# Altium schematic sheet Power_Supply.SchDoc: Dahlia Carrier Board
size A3; Organization: Toradex AG; Address1: Ebenaustrasse 10; Address2: Horw; Address3: 6048; Address4: Switzerland; DocumentNumber: 3; Revision: V1.1; SheetNumber: 3; SheetTotal: 21; PageSetup: Record=PageOptions|CenterHorizontal=True|CenterVertical=True|PrintScale=0.71|XCorrection=1.00|YCorrection=1.00|PrintKind=1|BorderSize=5000000|LeftOffset=0|BottomOffset=0|Orientation=2|PaperLength=1000|PaperWidth=1000|Scale=100|PaperSource=15|PrintQuality=600|MediaType=1|DitherType=10|PaperKind=A4|PrintScaleMode=1
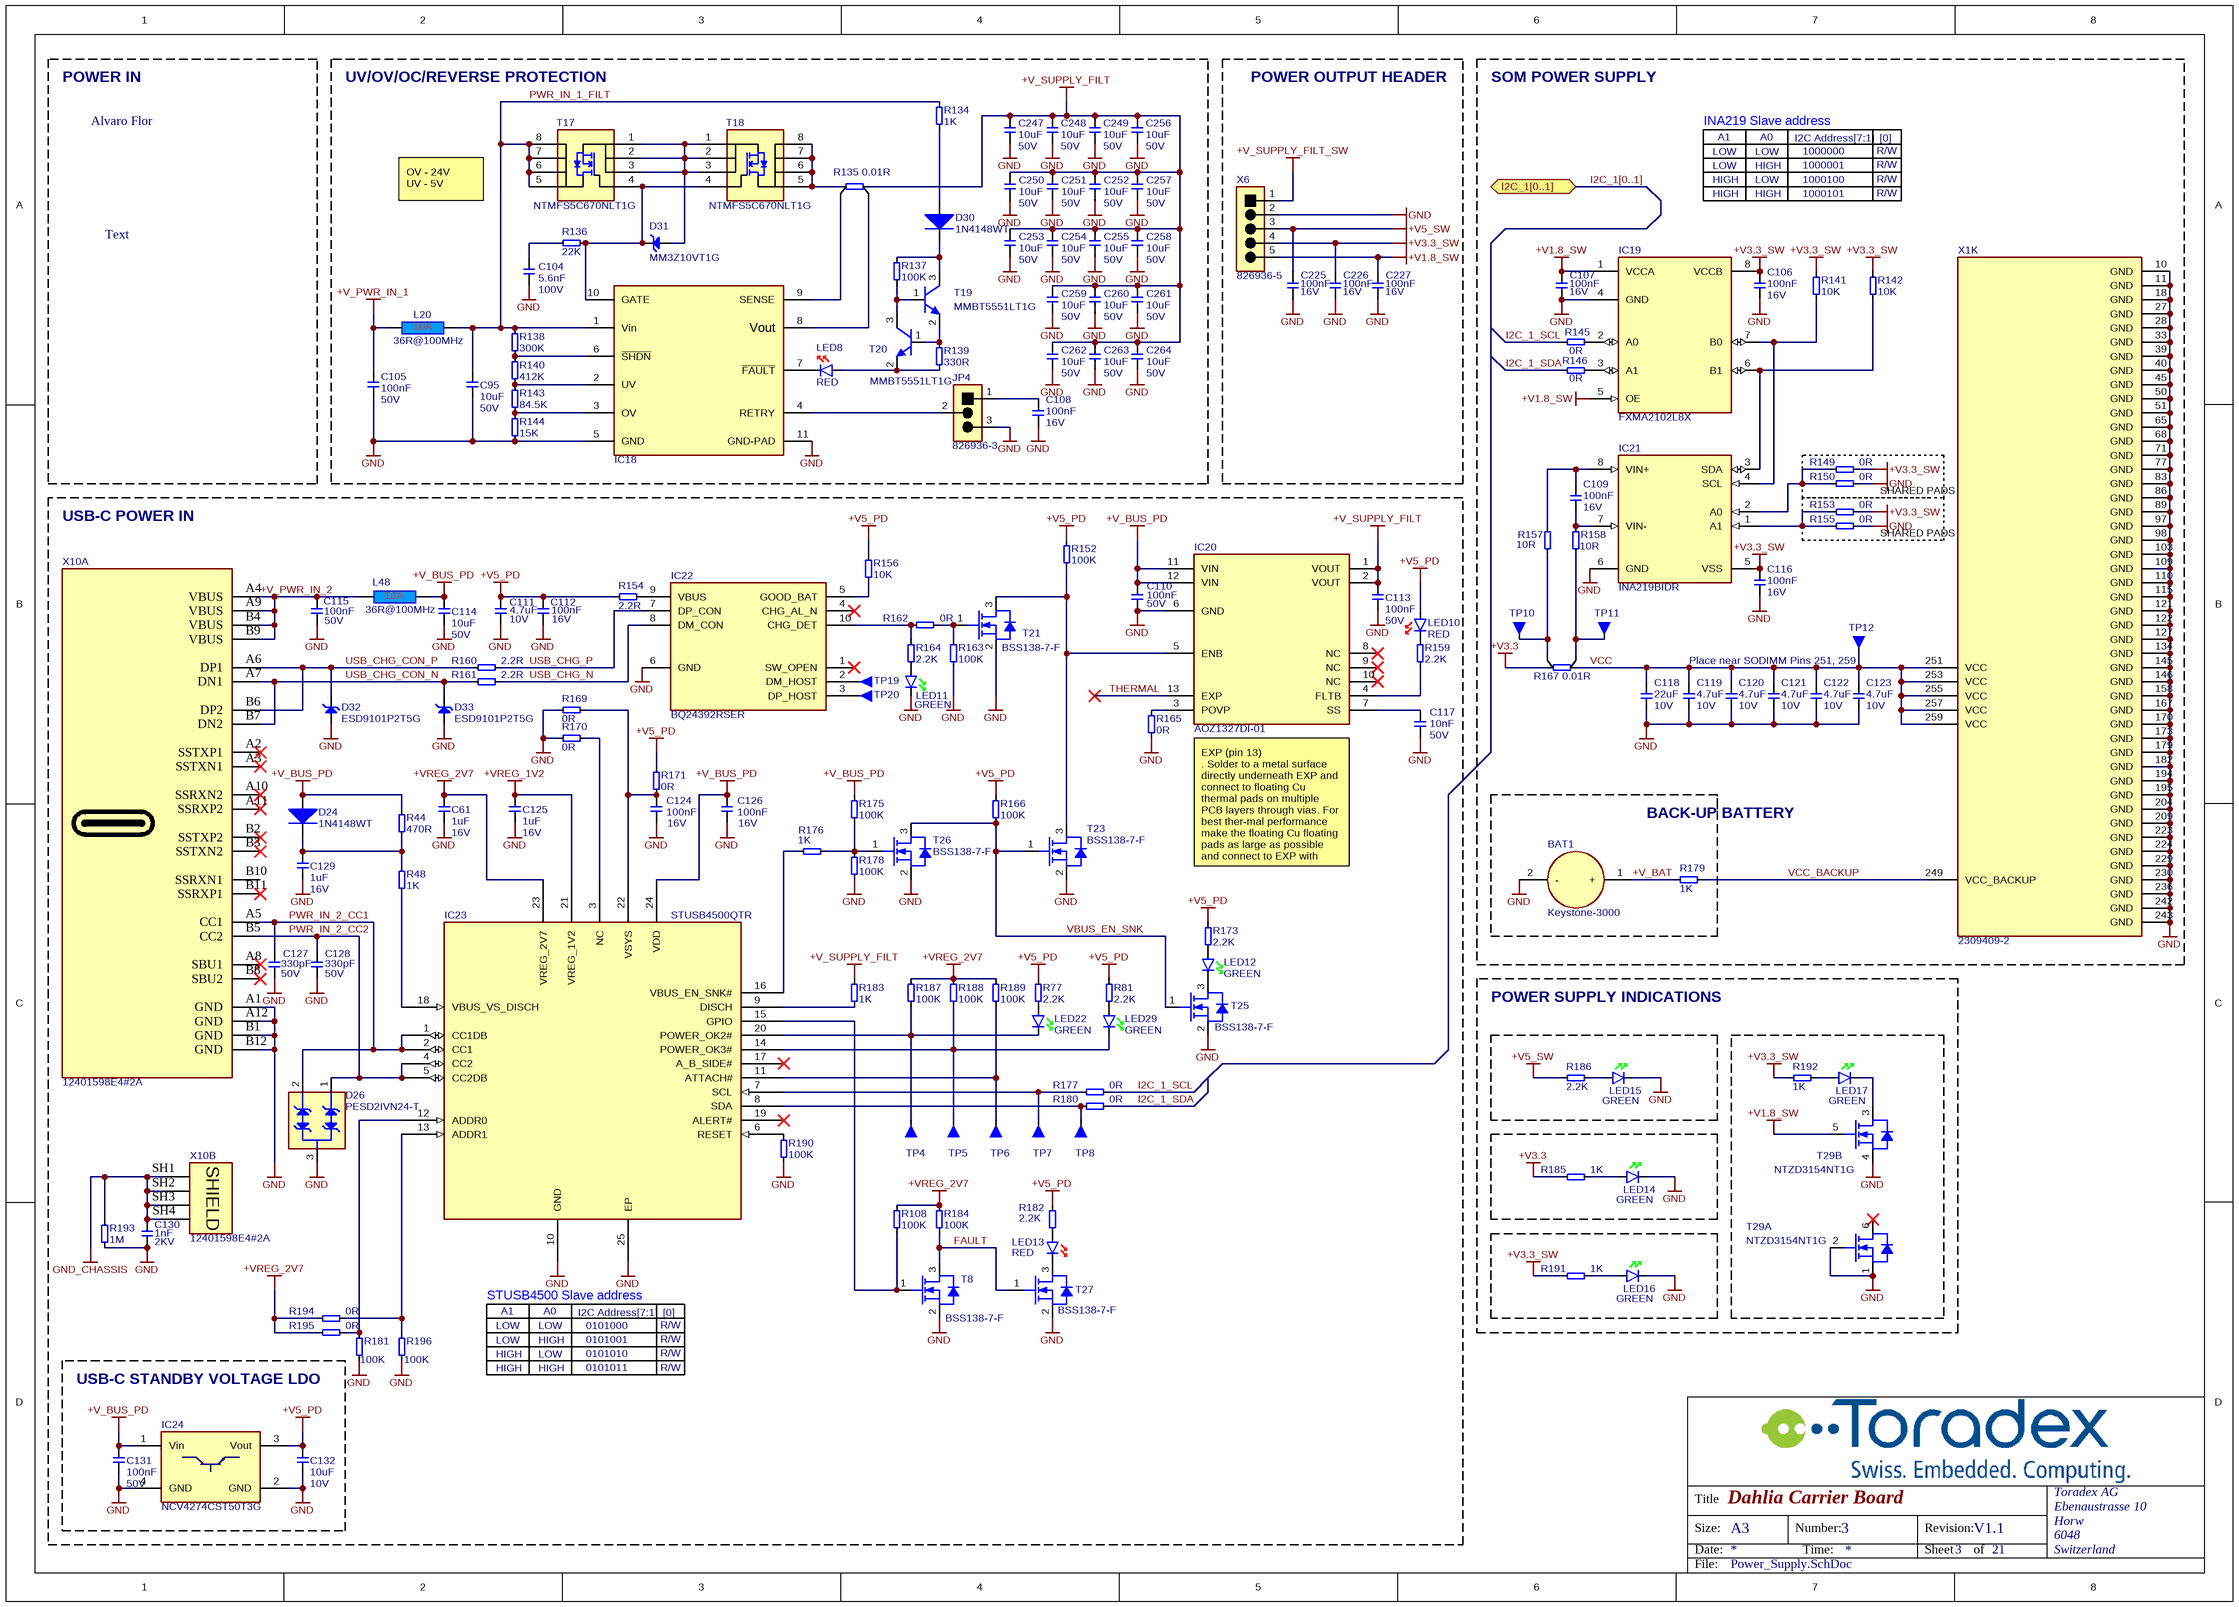
[diagram p0: Power_Supply.SchDoc]

## Parts
BAT1  Keystone-3000  [T_Keystone_3000]
C61  Rating: 16V  [CAPC1005X60N]  (hidden comment: 1uF)
C95  Rating: 50V  [T_CAPC1206X60N]  (hidden comment: 10uF)
C104  Rating: 100V  [T_CAPC1206X180N]  (hidden comment: 5.6nF)
C105  Rating: 50V  [CAPC1005X60N]  (hidden comment: 100nF)
C106  Rating: 16V  [CAPC1005X60N]  (hidden comment: 100nF)
C107  Rating: 16V  [CAPC1005X60N]  (hidden comment: 100nF)
C108  Rating: 16V  [CAPC1005X60N]  (hidden comment: 100nF)
C109  Rating: 16V  [CAPC1005X60N]  (hidden comment: 100nF)
C110  Rating: 50V  [CAPC1005X60N]  (hidden comment: 100nF)
C111  Rating: 10V  [T_CAPC0603X33N]  (hidden comment: 4.7uF)
C112  Rating: 16V  [CAPC1005X60N]  (hidden comment: 100nF)
C113  Rating: 50V  [CAPC1005X60N]  (hidden comment: 100nF)
C114  Rating: 50V  [T_CAPC1206X60N]  (hidden comment: 10uF)
C115  Rating: 50V  [CAPC1005X60N]  (hidden comment: 100nF)
C116  Rating: 16V  [CAPC1005X60N]  (hidden comment: 100nF)
C117  Rating: 50V  [CAPC1005X60N]  (hidden comment: 10nF)
C118  Rating: 10V  [T_CAPC0805X125N]  (hidden comment: 22uF)
C119  Rating: 10V  [T_CAPC0603X33N]  (hidden comment: 4.7uF)
C120  Rating: 10V  [T_CAPC0603X33N]  (hidden comment: 4.7uF)
C121  Rating: 10V  [T_CAPC0603X33N]  (hidden comment: 4.7uF)
C122  Rating: 10V  [T_CAPC0603X33N]  (hidden comment: 4.7uF)
C123  Rating: 10V  [T_CAPC0603X33N]  (hidden comment: 4.7uF)
C124  Rating: 16V  [CAPC1005X60N]  (hidden comment: 100nF)
C125  Rating: 16V  [CAPC1005X60N]  (hidden comment: 1uF)
C126  Rating: 16V  [CAPC1005X60N]  (hidden comment: 100nF)
C127  Rating: 50V  [CAPC1005X60N]  (hidden comment: 330pF)
C128  Rating: 50V  [CAPC1005X60N]  (hidden comment: 330pF)
C129  Rating: 16V  [CAPC1005X60N]  (hidden comment: 1uF)
C130  Rating: 2KV  [T_CAPC1206X180N]  (hidden comment: 1nF)
C131  Rating: 50V  [CAPC1005X60N]  (hidden comment: 100nF)
C132  Rating: 10V  [T_CAPC0603X33N]  (hidden comment: 10uF)
C225  Rating: 16V  [CAPC1005X60N]  (hidden comment: 100nF)
C226  Rating: 16V  [CAPC1005X60N]  (hidden comment: 100nF)
C227  Rating: 16V  [CAPC1005X60N]  (hidden comment: 100nF)
C247  Rating: 50V  [T_CAPC1206X60N]  (hidden comment: 10uF)
C248  Rating: 50V  [T_CAPC1206X60N]  (hidden comment: 10uF)
C249  Rating: 50V  [T_CAPC1206X60N]  (hidden comment: 10uF)
C250  Rating: 50V  [T_CAPC1206X60N]  (hidden comment: 10uF)
C251  Rating: 50V  [T_CAPC1206X60N]  (hidden comment: 10uF)
C252  Rating: 50V  [T_CAPC1206X60N]  (hidden comment: 10uF)
C253  Rating: 50V  [T_CAPC1206X60N]  (hidden comment: 10uF)
C254  Rating: 50V  [T_CAPC1206X60N]  (hidden comment: 10uF)
C255  Rating: 50V  [T_CAPC1206X60N]  (hidden comment: 10uF)
C256  Rating: 50V  [T_CAPC1206X60N]  (hidden comment: 10uF)
C257  Rating: 50V  [T_CAPC1206X60N]  (hidden comment: 10uF)
C258  Rating: 50V  [T_CAPC1206X60N]  (hidden comment: 10uF)
C259  Rating: 50V  [T_CAPC1206X60N]  (hidden comment: 10uF)
C260  Rating: 50V  [T_CAPC1206X60N]  (hidden comment: 10uF)
C261  Rating: 50V  [T_CAPC1206X60N]  (hidden comment: 10uF)
C262  Rating: 50V  [T_CAPC1206X60N]  (hidden comment: 10uF)
C263  Rating: 50V  [T_CAPC1206X60N]  (hidden comment: 10uF)
C264  Rating: 50V  [T_CAPC1206X60N]  (hidden comment: 10uF)
D24  1N4148WT  [SOD-523F]
D26  PESD2IVN24-T  [SOT95P230X110-3N]
D30  1N4148WT  [SOD-523F]
D31  MM3Z10VT1G  [T_SOD-323]
D32  ESD9101P2T5G  [SOD-923]
D33  ESD9101P2T5G  [SOD-923]
IC18  LTC4368IDD-2#PBF  [IC-DFN50P300X300X75-10N]  (value not drawn)
IC19  FXMA2102L8X  [IC-MicroPak50P160X2160X55-8N]
IC20  AOZ1327DI-01  [IC-A&O-AOZ1327DI-01]
IC21  Manufacturer Part No.: INA219BIDR  [SOIC127P600X173-8N]  (hidden comment: INA219)
IC22  BQ24392RSER  [IC-TI-BQ24392RSER]
IC23  STUSB4500QTR  [T_STUSB4500QTR]
IC24  NCV4274CST50T3G  [T_ON_NCV4264-2ST50T3G]
JP4  826936-3  [T_TYCO_826936-3]
L20  36R@100MHz  [T_Laird_35F0121-0SR-10]
L48  36R@100MHz  [T_Laird_35F0121-0SR-10]
LED8  Color: RED  [T_Liteon_LTST-C190KRKT]  (hidden comment: LTST-C190KRKT)
LED10  Color: RED  [T_Liteon_LTST-C190KRKT]  (hidden comment: LTST-C190KRKT)
LED11  Color: GREEN  [T_Liteon_LTST-C190GKT]  (hidden comment: LTST-C190GKT)
LED12  Color: GREEN  [T_Liteon_LTST-C190GKT]  (hidden comment: LTST-C190GKT)
LED13  Color: RED  [T_Liteon_LTST-C190KRKT]  (hidden comment: LTST-C190KRKT)
LED14  Color: GREEN  [T_Liteon_LTST-C190GKT]  (hidden comment: LTST-C190GKT)
LED15  Color: GREEN  [T_Liteon_LTST-C190GKT]  (hidden comment: LTST-C190GKT)
LED16  Color: GREEN  [T_Liteon_LTST-C190GKT]  (hidden comment: LTST-C190GKT)
LED17  Color: GREEN  [T_Liteon_LTST-C190GKT]  (hidden comment: LTST-C190GKT)
LED22  Color: GREEN  [T_Liteon_LTST-C190GKT]  (hidden comment: LTST-C190GKT)
LED29  Color: GREEN  [T_Liteon_LTST-C190GKT]  (hidden comment: LTST-C190GKT)
R44  470R  [T_RESC0603X30N]
R48  1K  [T_RESC0603X30N]
R77  2.2K  [RESC1005X40N]
R81  2.2K  [RESC1005X40N]
R108  100K  [RESC1005X40N]
R134  1K  [RESC1005X40N]
R135  0.01R  [RESWSK1206]
R136  22K  [RESC3216X75N]
R137  100K  [RESC1005X40N]
R138  300K  [RESC3216X75N]
R139  330R  [RESC1005X40N]
R140  412K  [RESC3216X75N]
R141  10K  [RESC1005X40N]
R142  10K  [RESC1005X40N]
R143  84.5K  [RESC3216X75N]
R144  15K  [RESC3216X75N]
R145  0R  [T_RESC0603X30N]
R146  0R  [T_RESC0603X30N]
R149  0R  [T_RESC0603X30N]
R150  0R  [T_RESC0603X30N]
R152  100K  [RESC1005X40N]
R153  0R  [T_RESC0603X30N]
R154  2.2R  [T_RESC0603X30N]
R155  0R  [T_RESC0603X30N]
R156  10K  [RESC1005X40N]
R157  10R  [RESC1005X40N]
R158  10R  [RESC1005X40N]
R159  2.2K  [RESC1005X40N]
R160  2.2R  [T_RESC0603X30N]
R161  2.2R  [T_RESC0603X30N]
R162  0R  [T_RESC0603X30N]
R163  100K  [RESC1005X40N]
R164  2.2K  [RESC1005X40N]
R165  0R  [T_RESC0603X30N]
R166  100K  [RESC1005X40N]
R167  0.01R  [RESWSK1206]
R169  0R  [T_RESC0603X30N]
R170  0R  [T_RESC0603X30N]
R171  0R  [T_RESC0603X30N]
R173  2.2K  [RESC1005X40N]
R175  100K  [RESC1005X40N]
R176  1K  [T_RESC0603X30N]
R177  0R  [T_RESC0603X30N]
R178  100K  [RESC1005X40N]
R179  1K  [RESC1005X40N]
R180  0R  [T_RESC0603X30N]
R181  100K  [RESC1005X40N]
R182  2.2K  [RESC1005X40N]
R183  1K  [T_RESC0603X30N]
R184  100K  [RESC1005X40N]
R185  1K  [RESC1005X40N]
R186  2.2K  [RESC1005X40N]
R187  100K  [RESC1005X40N]
R188  100K  [RESC1005X40N]
R189  100K  [RESC1005X40N]
R190  100K  [RESC1005X40N]
R191  1K  [RESC1005X40N]
R192  1K  [RESC1005X40N]
R193  1M  [RESC3216X75N]
R194  0R  [T_RESC0603X30N]
R195  0R  [T_RESC0603X30N]
R196  100K  [RESC1005X40N]
T8  BSS138-7-F  [SOT95P237X112-3N]
T17  NTMFS5C670NLT1G  [T_ONSemi_NTMFS5C670NLT1G]
T18  NTMFS5C670NLT1G  [T_ONSemi_NTMFS5C670NLT1G]
T19  MMBT5551LT1G  [ONSC-SOT-23-3-318-08_V]
T20  MMBT5551LT1G  [ONSC-SOT-23-3-318-08_V]
T21  BSS138-7-F  [SOT95P237X112-3N]
T23  BSS138-7-F  [SOT95P237X112-3N]
T25  BSS138-7-F  [SOT95P237X112-3N]
T26  BSS138-7-F  [SOT95P237X112-3N]
T27  BSS138-7-F  [SOT95P237X112-3N]
T29  Manufacturer Part No.: NTZD3154NT1G  [SOTFL50P160X60-6N]  (hidden comment: T-ONSemi-NTZD3154NT1G)  (parts A,B of 2)
TP4  Testpin-THT  [T_TP-THT]  (value not drawn)  (no BOM)
TP5  Testpin-THT  [T_TP-THT]  (value not drawn)  (no BOM)
TP6  Testpin-THT  [T_TP-THT]  (value not drawn)  (no BOM)
TP7  Testpin-THT  [T_TP-THT]  (value not drawn)  (no BOM)
TP8  Testpin-THT  [T_TP-THT]  (value not drawn)  (no BOM)
TP10  Testpin-THT  [T_TP-THT]  (value not drawn)  (no BOM)
TP11  Testpin-THT  [T_TP-THT]  (value not drawn)  (no BOM)
TP12  Testpin-THT  [T_TP-THT]  (value not drawn)  (no BOM)
TP19  Testpin-THT  [T_TP-THT]  (value not drawn)  (no BOM)
TP20  Testpin-THT  [T_TP-THT]  (value not drawn)  (no BOM)
X1  2309409-2  [CON-TE-2309409-2-SOLDERABLE-STANDOFFS]  (part K of 23)
X6  826936-5  [T_TYCO_826936-5]
X10  12401598E4#2A  [CON-AMPHENOL-12401598E4#2A]  (parts A,B of 2)

## Blocks framed on the sheet
UV/OV/OC/REVERSE PROTECTION: C95 C104 C105 C108 C247-C264 D30 D31 IC18 JP4 L20 LED8 R134-R140 R143 R144 T17-T20
POWER OUTPUT HEADER: C225-C227 X6
SHARED PADS: R149 R150
USB-C POWER IN: C61 C110-C115 C117 C124-C130 D24 D26 D32 D33 IC20 IC22 IC23 L48 LED10-LED13 LED22 LED29 R44 R48 R77 R81 R108 R152 R154 R156 R159-R166 R169-R171 R173 R175-R178 R180-R184 R187-R190 R193-R196 T8 T21 T23 T25-T27 TP4-TP8 TP19 TP20 X10
POWER SUPPLY INDICATIONS: LED14-LED17 R185 R186 R191 R192 T29
USB-C STANDBY VOLTAGE LDO: C131 C132 IC24

## Ports
I2C_1[0..1] (bidir)

## Nets
+V1.8_SW: C107.2 C227.2 IC19.1(VCCA) IC19.5(OE) T29.5(G) X6.5
+V3.3: R167.1 R185.1
+V3.3_SW: C106.2 C116.2 C226.2 IC19.8(VCCB) IC21.5(VSS) R141.2 R142.2 R149.2 R153.2 R191.1 R192.1 X6.4
+V5_PD: C111.2 C112.2 C132.2 IC24.3(Vout) LED10.A R77.1 R81.1 R152.2 R154.2 R156.2 R166.2 R171.2 R173.1 R182.1
+V5_SW: C225.2 R186.2 X6.3
+V_BUS_PD: C110.2 C114.2 C126.2 C131.2 D24.A IC20.11(VIN) IC20.12(VIN) IC23.24(VDD) IC24.1(Vin) L48.2 R44.2 R175.2
+V_PWR_IN_1: C105.2 L20.1
+V_SUPPLY_FILT: C113.1 C247.2 C248.2 C249.2 C250.2 C251.2 C252.2 C253.2 C254.2 C255.2 C256.2 C257.2 C258.2 C259.2 C260.2 C261.2 C262.2 C263.2 C264.2 IC20.1(VOUT) IC20.2(VOUT) R135.4 R183.2
+V_SUPPLY_FILT_SW: X6.1
+VREG_1V2: C125.1 IC23.21(VREG_1V2)
+VREG_2V7: C61.1 IC23.23(VREG_2V7) R108.2 R184.2 R187.1 R188.1 R189.1 R194.2 R195.2
GND: BAT1.2(-) C61.2 C95.1 C104.1 C105.1 C106.1 C107.1 C108.2 C110.1 C111.1 C112.1 C113.2 C114.1 C115.1 C116.1 C117.1 C118.1 C119.1 C120.1 C121.1 C122.1 C123.1 C124.1 C125.2 C126.1 C127.1 C128.1 C129.2 C130.1 C131.1 C132.1 C225.1 C226.1 C227.1 C247.1 C248.1 C249.1 C250.1 C251.1 C252.1 C253.1 C254.1 C255.1 C256.1 C257.1 C258.1 C259.1 C260.1 C261.1 C262.1 C263.1 C264.1 D26.3 D32.2(A) D33.2(A) IC18.5(GND) IC18.11(GND-PAD) IC19.4(GND) IC20.6(GND) IC21.6(GND) IC22.6(GND) IC23.10(GND) IC23.25(EP) IC24.2(GND) IC24.4(GND) JP4.3 LED11.K LED14.K LED15.K LED16.K R144.1 R150.2 R155.2 R163.1 R165.1 R169.1 R170.1 R178.1 R181.1 R190.2 R193.1 R196.1 T8.2(S) T21.2(S) T23.2(S) T25.2(S) T26.2(S) T27.2(S) T29.1(S) T29.2(G) T29.4(S) X1.10(GND) X1.11(GND) X1.18(GND) X1.27(GND) X1.28(GND) X1.33(GND) X1.39(GND) X1.40(GND) X1.45(GND) X1.50(GND) X1.51(GND) X1.65(GND) X1.68(GND) X1.71(GND) X1.77(GND) X1.83(GND) X1.86(GND) X1.89(GND) X1.97(GND) X1.98(GND) X1.103(GND) X1.109(GND) X1.110(GND) X1.115(GND) X1.121(GND) X1.122(GND) X1.127(GND) X1.134(GND) X1.145(GND) X1.146(GND) X1.158(GND) X1.167(GND) X1.170(GND) X1.173(GND) X1.179(GND) X1.182(GND) X1.194(GND) X1.195(GND) X1.204(GND) X1.209(GND) X1.223(GND) X1.224(GND) X1.229(GND) X1.230(GND) X1.236(GND) X1.242(GND) X1.243(GND) X6.2 X10.A1(GND) X10.A12(GND) X10.B1(GND) X10.B12(GND)
GND_CHASSIS: C130.2 R193.2 X10.SH1(SHIELD) X10.SH2(SHIELD) X10.SH3(SHIELD) X10.SH4(SHIELD)
+V_BAT: BAT1.1(+) R179.2
+V_PWR_IN_2: C115.2 L48.1 X10.A4(VBUS) X10.A9(VBUS) X10.B4(VBUS) X10.B9(VBUS)
FAULT: R184.1 T8.3(D) T27.1(G)
I2C_1_SCL: R145.1 R177.1
I2C_1_SDA: R146.1 R180.1
PWR_IN_1_FILT: C95.2 IC18.1(Vin) L20.2 R134.2 R138.2 T17.5(D) T17.6(D) T17.7(D) T17.8(D)
PWR_IN_2_CC1: C127.2 D26.2 IC23.1(CC1DB) IC23.2(CC1) X10.A5(CC1)
PWR_IN_2_CC2: C128.2 D26.1 IC23.4(CC2) IC23.5(CC2DB) X10.B5(CC2)
THERMAL: IC20.13(EXP)
USB_CHG_CON_N: D33.1(C) R161.2 X10.A7(DN1) X10.B7(DN2)
USB_CHG_CON_P: D32.1(C) R160.2 X10.A6(DP1) X10.B6(DP2)
USB_CHG_N: IC22.8(DM_CON) R161.1
USB_CHG_P: IC22.7(DP_CON) R160.1
VBUS_EN_SNK: R166.1 T23.1(G) T25.1(G) T26.3(D)
VCC: C118.2 C119.2 C120.2 C121.2 C122.2 C123.2 R167.4 TP12.1 X1.251(VCC) X1.253(VCC) X1.255(VCC) X1.257(VCC) X1.259(VCC)
VCC_BACKUP: R179.1 X1.249(VCC_BACKUP)
NetC104_2: C104.2 R136.1
NetC108_1: C108.1 JP4.1
NetC109_1: C109.1 IC21.7(VIN-) R158.2
NetC109_2: C109.2 IC21.8(VIN+) R157.2
NetC117_2: C117.2 IC20.7(SS)
NetC124_2: C124.2 IC23.22(VSYS) R169.2 R171.1
NetC129_1: C129.1 D24.C R44.1 R48.2
NetD30_A: D30.A R134.1
NetD30_C: D30.C R137.2 T19.3(C)
NetD31_1: D31.1(C) IC18.10(GATE) R136.2 T17.4(G) T18.4(G)
NetD31_2: D31.2(A) T17.1(S) T17.2(S) T17.3(S) T18.1(S) T18.2(S) T18.3(S)
NetIC18_2: IC18.2(UV) R140.1 R143.2
NetIC18_3: IC18.3(OV) R143.1 R144.2
NetIC18_4: IC18.4(RETRY) JP4.2
NetIC18_6: IC18.6(~{SHDN}) R138.1 R140.2
NetIC18_7: IC18.7(~{FAULT}) LED8.K
NetIC18_8: IC18.8(Vout) R135.3
NetIC18_9: IC18.9(SENSE) R135.2
NetIC19_2: IC19.2(A0) R145.2
NetIC19_3: IC19.3(A1) R146.2
NetIC19_6: IC19.6(B1) IC21.3(SDA) R142.1
NetIC19_7: IC19.7(B0) IC21.4(SCL) R141.1
NetIC20_3: IC20.3(POVP) R165.2
NetIC20_4: IC20.4(FLTB) R159.2
NetIC20_5: IC20.5(ENB) R152.1 T21.3(D) T23.3(D)
NetIC21_1: IC21.1(A1) R153.1 R155.1
NetIC21_2: IC21.2(A0) R149.1 R150.1
NetIC22_2: IC22.2(DM_HOST) TP19.1
NetIC22_3: IC22.3(DP_HOST) TP20.1
NetIC22_5: IC22.5(GOOD_BAT) R156.1
NetIC22_9: IC22.9(VBUS) R154.1
NetIC22_10: IC22.10(CHG_DET) R162.1 R164.2
NetIC23_3: IC23.3(NC) R170.2
NetIC23_6: IC23.6(RESET) R190.1
NetIC23_7: IC23.7(SCL) R177.2 TP7.1
NetIC23_8: IC23.8(SDA) R180.2 TP8.1
NetIC23_9: IC23.9(DISCH) R183.1
NetIC23_11: IC23.11(ATTACH#) R189.2 TP6.1
NetIC23_12: IC23.12(ADDR0) R181.2 R195.1
NetIC23_13: IC23.13(ADDR1) R194.1 R196.2
NetIC23_14: IC23.14(POWER_OK3#) LED29.K R188.2 TP5.1
NetIC23_15: IC23.15(GPIO) R108.1 T8.1(G)
NetIC23_16: IC23.16(VBUS_EN_SNK#) R176.2
NetIC23_18: IC23.18(VBUS_VS_DISCH) R48.1
NetIC23_20: IC23.20(POWER_OK2#) LED22.K R187.2 TP4.1
NetLED8_A: LED8.A R139.1 T20.2(E)
NetLED10_K: LED10.K R159.1
NetLED11_A: LED11.A R164.1
NetLED12_A: LED12.A R173.2
NetLED12_K: LED12.K T25.3(D)
NetLED13_A: LED13.A R182.2
NetLED13_K: LED13.K T27.3(D)
NetLED14_A: LED14.A R185.2
NetLED15_A: LED15.A R186.1
NetLED16_A: LED16.A R191.2
NetLED17_A: LED17.A R192.2
NetLED17_K: LED17.K T29.3(D)
NetLED22_A: LED22.A R77.2
NetLED29_A: LED29.A R81.2
NetR135_1: R135.1 T18.5(D) T18.6(D) T18.7(D) T18.8(D)
NetR137_1: R137.1 T19.1(B) T20.3(C)
NetR139_2: R139.2 T19.2(E) T20.1(B)
NetR157_1: R157.1 R167.2 TP10.1
NetR158_1: R158.1 R167.3 TP11.1
NetR162_2: R162.2 R163.2 T21.1(G)
NetR175_1: R175.1 R176.1 R178.2 T26.1(G)

Not connected (* = marked no-connect by the designer): IC20 8(NC)* 9(NC)* 10(NC)*; IC22 1(SW_OPEN)* 4(CHG_AL_N)*; IC23 17(A_B_SIDE#)* 19(ALERT#)*; T29 6(D)*; X10 A2(SSTXP1)* A3(SSTXN1)* A8(SBU1)* A10(SSRXN2)* A11(SSRXP2)* B2(SSTXP2)* B3(SSTXN2)* B8(SBU2)* B10(SSRXN1) B11(SSRXP1)*

## Buses and harness runs
bus I2C_1[0..1] = port I2C_1[0..1]

## Notes on the sheet
- POWER IN
- SOM POWER SUPPLY
- Alvaro Flor
- INA219 Slave address
- LOW
- HIGH
- A1
- A0
- I2C Address[7:1]
- 1000000
- 1000001
- 1000100
- R/W
- [0]
- Text
- OV - 24V
  UV - 5V
- 1000101
- (near R155) SHARED PADS
- Place near SODIMM Pins 251, 259
- BACK-UP BATTERY
- EXP (pin 13)
  . Solder to a metal surface directly underneath EXP and connect to floating Cu thermal pads on multiple PCB layers through vias. For best ther-mal performance make the floating Cu floating pads as large as possible and connect to EXP with multiple vias
- STUSB4500 Slave address
- 0101000
- 0101001
- 0101010
- 0101011
- Title
- Size:
- Date:
- A3
- Number:
- Time:
- Revision:
- Sheet
- of
- File:

## Library data of the parts
BAT1 = BAT-Keystone-3000: Battery Holder; Manufacturer Part No.: 3000; Manufacturer Name: Keystone
C61 C125 C129 = C-X5R-1uF-16V-20%-0402: Capacitor Ceramic X5R 1uF 16V 20% 0402; Tolerance: 20%; Type: X5R; Value: 1uF
C95 C114 C247-C264 = C-X5R-10uF-50V-20%-1206: Capacitor Ceramic X5R 10uF 50V 20% 1206; Tolerance: 20%; Type: X5R; Value: 10uF
C104 = C-X7R-5.6n-100V-10%-1206: Capacitor Ceramic X7R 5.6nF 100V 10% 1206; Tolerance: 10%; Type: X7R; Value: 5.6nF
C105 C110 C113 C115 C131 = C-X7R-100nF-50V-10%-0402: Capacitor Ceramic X7R 100nF 50V 10% 0402; Tolerance: 10%; Type: X7R; Value: 100nF
C106-C109 C112 C116 C124 C126 C225-C227 = C-X7R-100nF-16V-10%-0402: Capacitor Ceramic X7R 100nF 16V 10% 0402; Tolerance: 10%; Type: X7R; Value: 100nF
C111 C119-C123 = C-X5R-4.7uF-10V-10%-0603: Capacitor Ceramic X5R 4.7uF 10V 10% 0603; Tolerance: 10%; Type: X5R; Value: 4.7uF; ClassName: Power_Poly
C117 = C-X7R-10nF-50V-10%-0402: Capacitor Ceramic X7R 10nF 50V 10% 0402; Tolerance: 10%; Type: X7R; Value: 10nF
C118 = C-X5R-22uF-10V-20%-0805: Capacitor Ceramic X5R 22uF 10V 20% 0805; Tolerance: 20%; Type: X5R; Value: 22uF; ClassName: Power_Poly
C127 C128 = C-X7R-330pF-50V-10%-0402: Capacitor Ceramic X7R 330pF 50V 10% 0402; Tolerance: 10%; Type: X7R; Value: 330pF
C130 = C-X7R-1nF-2KV-10%-1206: Capacitor Ceramic X7R 1nF 2KV 10% 1206; Tolerance: 10%; Type: X7R; Value: 1nF
C132 = C-X5R-10uF-10V-20%-0603: Capacitor Ceramic X5R 10uF 10V 20% 0603; Tolerance: 20%; Type: X5R; Value: 10uF
D24 D30 = D-OnSemi-1N4148WT: Diode Standard 75V 200mA Surface Mount SOD-523F; Manufacturer Name: On Semi; Manufacturer Part No.: 1N4148WT
D26 = D-Nexperia-PESD2IVN24-T: TVS Array low cap; Manufacturer Name: Nexperia; Manufacturer Part No.: PESD2IVN24-T
D31 = D-OnSemi-MM3Z10VT1G: DIODE ZENER 10V 300MW SOD323; Manufacturer Name: OnSemi; Manufacturer Part No.: MM3Z10VT1G
D32 D33 = D-OnSemi-ESD9101P2T5G: ESD Protection Diode; Manufacturer Name: OnSemi; Manufacturer Part No.: ESD9101P2T5G
IC18 = IC-LIN-LTC4368IDD-2#PBF: Reverse Protection Controller with Bidirectional Circuit Breaker; Manufacturer Name: Linear; Package: *; Temperature Range: *; Manufacturer Part No.: LTC4368IDD-2#PBF
IC19 = IC-ONsemi-FXMA2102L8X: Voltage Level Translator for I2C Applications; Manufacturer Name: ONSemi; Manufacturer Part No.: FXMA2102L8X
IC20 = IC-A&O-AOZ1327DI-01: 20V Protection Switch with True Reverse Current Blocking; Manufacturer Name: Alpha and Omega; Manufacturer Part No.: AOZ1327DI-01
IC21 = IC-TI-INA219BIDR: CURRENT/POWER MONITOR with I2C Interface; Manufacturer Name: Texas Instruments
IC22 = IC-TI-BQ24392RSER: USB Charger Detection; Manufacturer Name: Texas Instruments; Manufacturer Part No.: BQ24392RSER
IC23 = IC-ST-STUSB4500QTR: Standalone USB PD sink controller with short-to-VBUS protections; Manufacturer Name: ST; Temperature Range: -40C to +105C; Package: 24-QFN-EP (4x4); Manufacturer Part No.: STUSB4500QTR
IC24 = IC-ON-NCV4274CST50T3G: LDO regulator, Vout = 5V, Iout(max) = 0.4A, Vin = 5.5V to 40V, SOT-223; Manufacturer Name: ON Semiconductor; Manufacturer Part No.: NCV4274CST50T3G
JP4 = CON-Tyco-826936-3-1X3-2.54mm-JP_1: Jumper, 3-Pin; Manufacturer Name: Tyco; No. of ways: 1X3; Pitch: 2.54mm; Manufacturer Part No.: 826936-3
L20 L48 = L-Laird-35F0121-0SR-10-10A-25%: Power Supply FB 10A; Tolerance: 25%; Rating: 10A; Value: 36R@100MHz; ClassName: Power_Poly
LED8 LED10 LED13 = LED-LiteOn-LTST-C190KRKT: LED red, Lite-On LTST-C190KRKT; Manufacturer Part No.: LTST-C190KRKT; Manufacturer Name: Lite-On
LED11 LED12 LED14-LED17 LED22 LED29 = LED-LiteOn-LTST-C190GKT: LED green Lite-ON LTST-C190GKT; Manufacturer Name: Lite-ON; Manufacturer Part No.: LTST-C190GKT
R44 = R-470R-63mW-1%-0603: Resistor 470 Ohm 63mW 1% 0603; Rating: 63mW; Tolerance: 1%; Value: 470R
R48 R176 R183 = R-1K-63mW-5%-0603: Resistor 1 Kohm 63mW 5% 0603; Rating: 63mW; Tolerance: 5%; Value: 1K
R77 R81 R159 R164 R173 R182 R186 = R-2.2K-63mW-5%-0402: Resistor 2.2 Kohm 63mW 5% 0402; Value: 2.2KR; Rating: 63mW; Tolerance: 5%
R108 R137 R152 R163 R166 R175 R178 R181 R184 R187-R190 R196 = R-100K-63mW-5%-0402: Resistor 100 Kohm 63mW 5% 0402; Rating: 63mW; Tolerance: 5%; Value: 100K
R134 R179 R185 R191 R192 = R-1K-63mW-5%-0402: Resistor 1 Kohm 63mW 5% 0402; Rating: 63mW; Tolerance: 5%; Value: 1K
R135 R167 = R-Vishay-WSK1206R0100FEA18: 10 mOhms ±1% 0.5W,Chip Resistor 1206 (3216 Metric) Current Sense, Moisture Resistant, Pulse Withstanding Metal Element; Manufacturer Name: Vishay; Rating: 0.5W; Tolerance: 1%; Value: 0.01R; Manufacturer Part No.: WSK1206R0100FEA18; ClassName: Power_Poly
R136 = R-22K-250mW-1%-1206: Resistor 22 Kohm 250mW 1% 1206; Rating: 250mW; Tolerance: 1%; Value: 22K
R138 = R-300K-250mW-1%-1206: Resistor 300 Kohm 250mW 1% 1206; Rating: 250mW; Tolerance: 1%; Value: 300K
R139 = R-330R-63mW-5%-0402: Resistor 330 ohm 63mW 5% 0402; Rating: 63mW; Tolerance: 5%; Value: 330R
R140 = R-412K-250mW-1%-1206: Resistor 412 Kohm 250mW 1% 1206; Rating: 250mW; Tolerance: 1%; Value: 412K
R141 R142 R156 = R-10K-63mW-5%-0402: Resistor 10 Kohm 63mW 5% 0402; Rating: 63mW; Tolerance: 5%; Value: 10K
R143 = R-84.5K-250mW-1%-1206: Resistor 84.5 Kohm 250mW 1% 1206; Rating: 250mW; Tolerance: 1%; Value: 84.5K
R144 = R-15K-250mW-1%-1206: Resistor 15 Kohm 250mW 1% 1206; Rating: 250mW; Tolerance: 1%; Value: 15K
R145 R146 R149 R150 R153 R155 R162 R165 R169-R171 R177 R180 R194 R195 = R-0R-63mW-1%-0603: Resistor 0 ohm 63mW 1% 0603; Rating: 63mW; Tolerance: 1%; Value: 0R
R154 R160 R161 = R-2.2R-63mW-5%-0603: Resistor 2.2 ohm 63mW 5% 0603; Rating: 63mW; Tolerance: 5%; Value: 2.2R
R157 R158 = R-10R-63mW-5%-0402: Resistor 10 ohm 63mW 5% 0402; Rating: 63mW; Tolerance: 5%; Value: 10R
R193 = R-1M-250mW-5%-1206: Resistor 1 Mohm 250mW 5% 1206; Rating: 250mW; Tolerance: 5%; Value: 1M
T8 T21 T23 T25-T27 = T-Diodes-BSS138-7-F: N-channel MOSFET, BSS138-7-F; Manufacturer Name: Diodes; Manufacturer Part No.: BSS138-7-F
T17 T18 = T-ONSemi-NTMFS5C670NLT1G: MOSFET N-CH 60V 68A SO8FL; Manufacturer Name: ONSemi; Manufacturer Part No.: NTMFS5C670NLT1G
T19 T20 = T-ONSemi-MMBT5551LT1G -SOT-23: Bipolar Transistor NPN 160V 600mA  225mW Surface Mount SOT-23-3; Manufacturer Name: ONSemi; Manufacturer Part No.: MMBT5551LT1G
T29 = T-ONSemi-NTZD3154NT1G: Dual N-Channel 20V (D-S)  MOSFET; Manufacturer Name: ONSemi
TP4-TP8 TP10-TP12 TP19 TP20 = Testpin-THT: Testpin THT
X1 = CON-TE-2309409-2: DDR4 SODIMM Socket, 260 pins, 5.2mm(H), 0.5mm Pitch; Manufacturer Name: TE; Temperature Range: -40C to +125C; Package: DDR4-SODIMM-260; Manufacturer Part No.: 2309409-2
X6 = CON-Tyco-826936-5-1X5-2.54mm: Header, 5-Pin; Manufacturer Name: Tyco; No. of ways: 1X5; Pitch: 2.54mm; Manufacturer Part No.: 826936-5
X10 = CON-Amphenol-12401598E4#2A: USB 3.1 Gen 2, Input Output Connectors, USB type C, Receptacle, Top mount, dual-row SMT, 1.6mmPCB; No. of ways: 24; Manufacturer Name: Amphenol; Manufacturer Part No.: 12401598E4#2A